# Altium project MAIN.PrjPcb
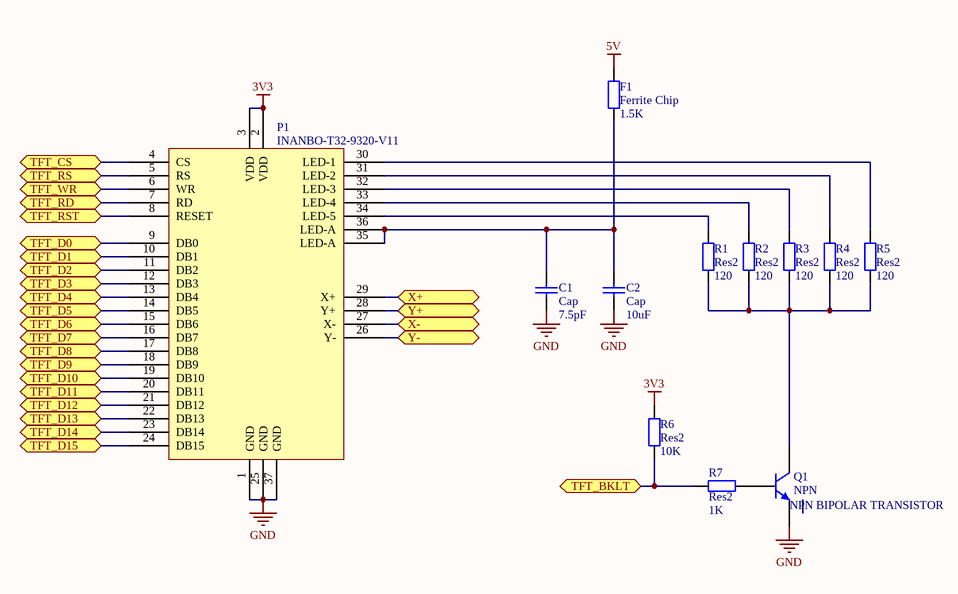
[diagram p0: LCD.SchDoc]
5 sheets, 80 parts. Net scope: flat (ports and power ports of the same name join across sheets).
Board file: MAIN.PcbDoc
Sheets:
  LCD.SchDoc
  MAIN.SchDoc
  WIFI.SchDoc
  USB.SchDoc
  RTC.SchDoc

## Sheet LCD.SchDoc
size A

### Parts
C1  Cap  value 7.5pF  [0603]
C2  Cap  value 10uF  [0805]
F1  Ferrite Chip  value 1.5K  [0603]
P1  INANBO-T32-9320-V11  [INANBO-T32-ILI9320-V11]
Q1  NPN  value NPN BIPOLAR TRANSISTOR  [SOT23_M]
R1  Res2  value 120  [0603]
R2  Res2  value 120  [0603]
R3  Res2  value 120  [0603]
R4  Res2  value 120  [0603]
R5  Res2  value 120  [0603]
R6  Res2  value 10K  [0603]
R7  Res2  value 1K  [0603]

### Ports
TFT_BKLT, TFT_CS, TFT_D0, TFT_D1, TFT_D2, TFT_D3, TFT_D4, TFT_D5, TFT_D6, TFT_D7, TFT_D8, TFT_D9, TFT_D10, TFT_D11, TFT_D12, TFT_D13, TFT_D14, TFT_D15, TFT_RD, TFT_RS, TFT_RST, TFT_WR, X+, X-, Y+, Y-

### Nets
3V3: P1.2(VDD) P1.3(VDD) R6.2
5V: F1.1
GND: C1.1 C2.1 P1.1(GND) P1.25(GND) P1.37(GND) Q1.3(E)
D0: P1.9(DB0) ; port TFT_D0
D1: P1.10(DB1) ; port TFT_D1
D2: P1.11(DB2) ; port TFT_D2
D3: P1.12(DB3) ; port TFT_D3
D4: P1.13(DB4) ; port TFT_D4
D5: P1.14(DB5) ; port TFT_D5
D6: P1.15(DB6) ; port TFT_D6
D7: P1.16(DB7) ; port TFT_D7
D8: P1.17(DB8) ; port TFT_D8
D9: P1.18(DB9) ; port TFT_D9
D10: P1.19(DB10) ; port TFT_D10
D11: P1.20(DB11) ; port TFT_D11
D12: P1.21(DB12) ; port TFT_D12
D13: P1.22(DB13) ; port TFT_D13
D14: P1.23(DB14) ; port TFT_D14
D15: P1.24(DB15) ; port TFT_D15
TFT_BKLT: R6.1 R7.2 ; port TFT_BKLT
TFT_CS: P1.4(CS) ; port TFT_CS
TFT_RD: P1.7(RD) ; port TFT_RD
TFT_RS: P1.5(RS) ; port TFT_RS
TFT_RST: P1.8(RESET) ; port TFT_RST
TFT_WR: P1.6(WR) ; port TFT_WR
X+: P1.29(X+) ; port X+
X-: P1.27(X-) ; port X-
Y+: P1.28(Y+) ; port Y+
Y-: P1.26(Y-) ; port Y-
NetC1_2: C1.2 C2.2 F1.2 P1.35(LED-A) P1.36(LED-A)
NetP1_30: P1.30(LED-1) R5.2
NetP1_31: P1.31(LED-2) R4.2
NetP1_32: P1.32(LED-3) R3.2
NetP1_33: P1.33(LED-4) R2.2
NetP1_34: P1.34(LED-5) R1.2
NetQ1_1: Q1.1(C) R1.1 R2.1 R3.1 R4.1 R5.1
NetQ1_2: Q1.2(B) R7.1

### Library data of the parts
C1 C2 = Cap: Capacitor; Supplier 1: Digi-Key
  C1: Supplier Part Number 1: 490-3565-1-ND
  C2: Supplier Part Number 1: 445-6857-1-ND
F1 = Res2: Supplier 1: Digi-Key; Supplier Part Number 1: 490-5216-1-ND
P1 = ER-TFT032-2: 3.2" TFT LCD module with touch panel; Supplier 1: INANBO; Supplier Part Number 1: INANBO-T32-9320-V11
Q1 = NPN: NPN Bipolar Transistor; pin to pad: 2>3 3>2; Supplier Part Number 1: MMBT2222ALT3GOSCT-ND; Supplier 1: Digi-Key
R1-R7 = Res2: Resistor; Supplier 1: Digi-Key
  R1-R5: Supplier Part Number 1: P120GCT-ND
  R6: Supplier Part Number 1: P10KGCT-ND
  R7: Supplier Part Number 1: 311-1.0KGRCT-ND

## Sheet MAIN.SchDoc
size B
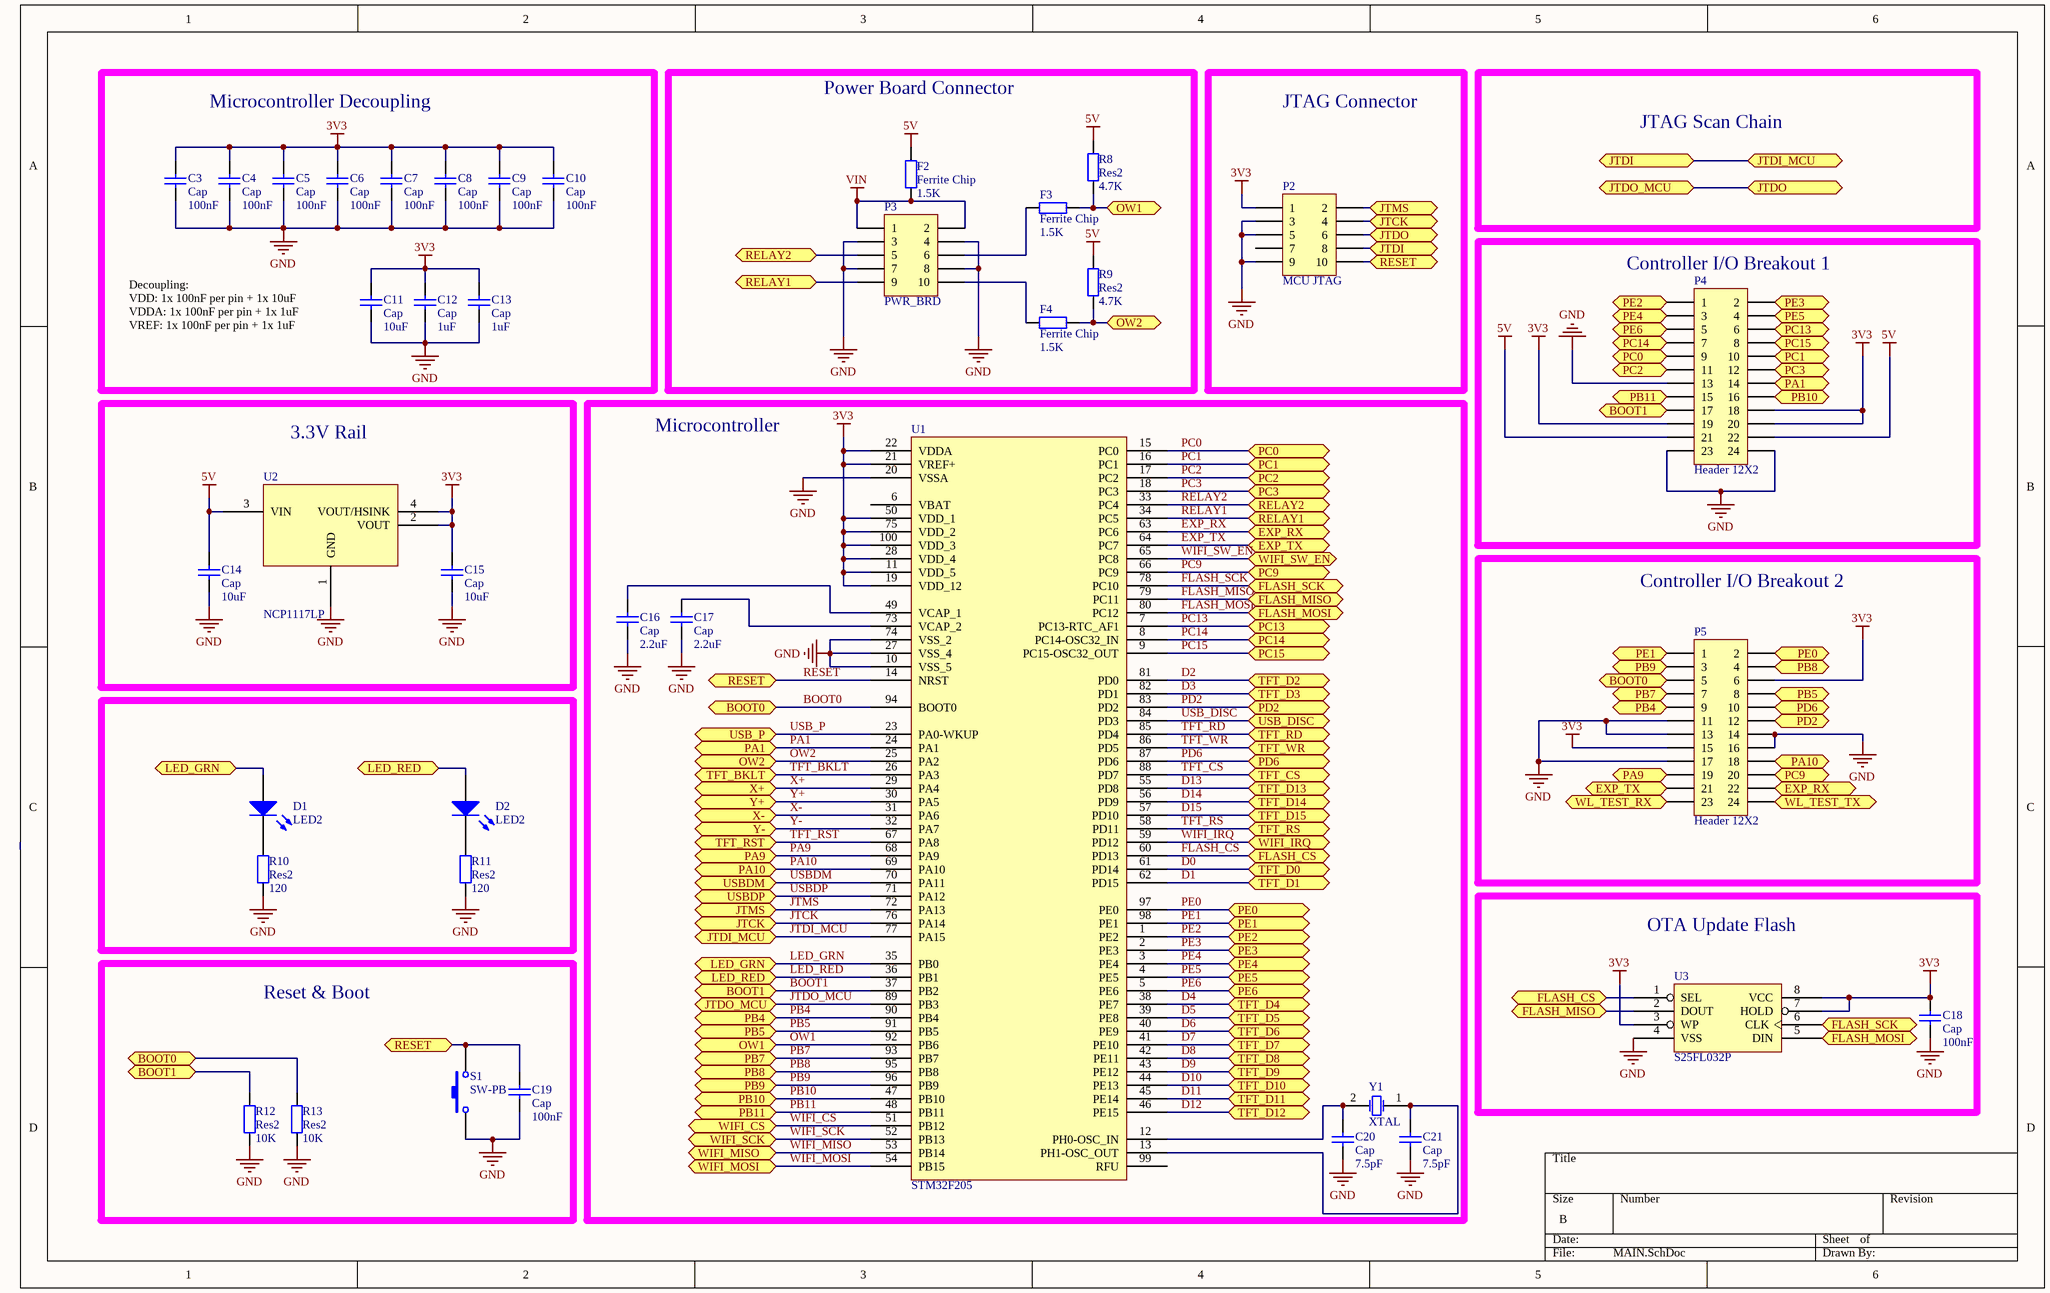
[diagram p1: MAIN.SchDoc]

### Parts
C3  Cap  value 100nF  [0603]
C4  Cap  value 100nF  [0603]
C5  Cap  value 100nF  [0603]
C6  Cap  value 100nF  [0603]
C7  Cap  value 100nF  [0603]
C8  Cap  value 100nF  [0603]
C9  Cap  value 100nF  [0603]
C10  Cap  value 100nF  [0603]
C11  Cap  value 10uF  [0805]
C12  Cap  value 1uF  [0603]
C13  Cap  value 1uF  [0603]
C14  Cap  value 10uF  [0805]
C15  Cap  value 10uF  [0805]
C16  Cap  value 2.2uF  [0603]
C17  Cap  value 2.2uF  [0603]
C18  Cap  value 100nF  [0603]
C19  Cap  value 100nF  [0603]
C20  Cap  value 7.5pF  [0603]
C21  Cap  value 7.5pF  [0603]
D1  LED2  [0603]
D2  LED2  [0603]
F2  Ferrite Chip  value 1.5K  [0603]
F3  Ferrite Chip  value 1.5K  [0603]
F4  Ferrite Chip  value 1.5K  [0603]
P2  MCU JTAG  [JTAG PTH]
P3  PWR_BRD  [HDR2X5]
P4  Header 12X2  [HDR2X12]
P5  Header 12X2  [HDR2X12]
R8  Res2  value 4.7K  [0603]
R9  Res2  value 4.7K  [0603]
R10  Res2  value 120  [0603]
R11  Res2  value 120  [0603]
R12  Res2  value 10K  [0603]
R13  Res2  value 10K  [0603]
S1  SW-PB  [FSM4JSMA]
U1  STM32F205  [LQFP-100]
U2  NCP1117LP  [SOT-223]
U3  S25FL032P  [SOC008]
Y1  XTAL  [HC49SD XTAL]

### Blocks framed on the sheet
Microcontroller Decoupling: C3-C13
Power Board Connector: F2-F4 P3 R8 R9
JTAG Connector: P2
Controller I/O Breakout 1: P4
3.3V Rail: C14 C15 U2
Microcontroller: C16 C17 C20 C21 U1 Y1
Controller I/O Breakout 2: P5
OTA Update Flash: C18 U3
Reset & Boot: C19 R12 R13 S1

### Ports
BOOT0, BOOT1, EXP_RX, EXP_TX, FLASH_CS, FLASH_MISO, FLASH_MOSI, FLASH_SCK, JTCK, JTDI, JTDI_MCU, JTDO, JTDO_MCU, JTMS, LED_GRN, LED_RED, OW1, OW2, PA1, PA9, PA10, PB4, PB5, PB7, PB8, PB9, PB10, PB11, PC0, PC1, PC2, PC3, PC9, PC13, PC14, PC15, PD2, PD6, PE0, PE1, PE2, PE3, PE4, PE5, PE6, RELAY1, RELAY2, RESET, TFT_BKLT, TFT_CS, TFT_D0, TFT_D1, TFT_D2, TFT_D3, TFT_D4, TFT_D5, TFT_D6, TFT_D7, TFT_D8, TFT_D9, TFT_D10, TFT_D11, TFT_D12, TFT_D13, TFT_D14, TFT_D15, TFT_RD, TFT_RS, TFT_RST, TFT_WR, USB_DISC, USB_P, USBDM, USBDP, WIFI_CS, WIFI_IRQ, WIFI_MISO, WIFI_MOSI, WIFI_SCK, WIFI_SW_EN, WL_TEST_RX, WL_TEST_TX, X+, X-, Y+, Y-

### Nets
3V3: C3.2 C4.2 C5.2 C6.2 C7.2 C8.2 C9.2 C10.2 C11.2 C12.2 C13.2 C15.2 C18.2 P2.1 P4.18 P4.19 P4.20 P5.6 P5.15 U1.11(VDD_5) U1.19(VDD_12) U1.21(VREF+) U1.22(VDDA) U1.28(VDD_4) U1.50(VDD_1) U1.75(VDD_2) U1.100(VDD_3) U2.2(VOUT) U2.4(VOUT/HSINK) U3.3(WP) U3.7(HOLD) U3.8(VCC)
5V: C14.2 F2.2 P4.21 P4.22 R8.2 R9.2 U2.3(VIN)
GND: C3.1 C4.1 C5.1 C6.1 C7.1 C8.1 C9.1 C10.1 C11.1 C12.1 C13.1 C14.1 C15.1 C16.1 C17.1 C18.1 C19.1 C20.1 C21.1 P2.3 P2.5 P2.9 P3.3 P3.4 P3.7 P3.8 P4.13 P4.23 P4.24 P5.11 P5.13 P5.14 P5.16 P5.17 R10.1 R11.1 R12.1 R13.1 S1.1 U1.10(VSS_5) U1.20(VSSA) U1.27(VSS_4) U1.74(VSS_2) U2.1(GND) U3.4(VSS)
VIN: F2.1 P3.1 P3.2
BOOT0: P5.5 R13.2 U1.94(BOOT0) ; port BOOT0
BOOT1: P4.17 R12.2 U1.37(PB2) ; port BOOT1
D0: U1.61(PD14) ; port TFT_D0
D1: U1.62(PD15) ; port TFT_D1
D2: U1.81(PD0) ; port TFT_D2
D3: U1.82(PD1) ; port TFT_D3
D4: U1.38(PE7) ; port TFT_D4
D5: U1.39(PE8) ; port TFT_D5
D6: U1.40(PE9) ; port TFT_D6
D7: U1.41(PE10) ; port TFT_D7
D8: U1.42(PE11) ; port TFT_D8
D9: U1.43(PE12) ; port TFT_D9
D10: U1.44(PE13) ; port TFT_D10
D11: U1.45(PE14) ; port TFT_D11
D12: U1.46(PE15) ; port TFT_D12
D13: U1.55(PD8) ; port TFT_D13
D14: U1.56(PD9) ; port TFT_D14
D15: U1.57(PD10) ; port TFT_D15
EXP_RX: P5.22 U1.63(PC6) ; port EXP_RX
EXP_TX: P5.21 U1.64(PC7) ; port EXP_TX
FLASH_CS: U1.60(PD13) U3.1(SEL) ; port FLASH_CS
FLASH_MISO: U1.79(PC11) U3.2(DOUT) ; port FLASH_MISO
FLASH_MOSI: U1.80(PC12) U3.5(DIN) ; port FLASH_MOSI
FLASH_SCK: U1.78(PC10) U3.6(CLK) ; port FLASH_SCK
JTCK: P2.4 U1.76(PA14) ; port JTCK
JTDI_MCU: P2.8 U1.77(PA15) ; port JTDI, port JTDI_MCU
JTDO_MCU: P2.6 U1.89(PB3) ; port JTDO, port JTDO_MCU
JTMS: P2.2 U1.72(PA13) ; port JTMS
LED_GRN: D1.1(A) U1.35(PB0) ; port LED_GRN
LED_RED: D2.1(A) U1.36(PB1) ; port LED_RED
OW1: F3.1 R8.1 U1.92(PB6) ; port OW1
OW2: F4.1 R9.1 U1.25(PA2) ; port OW2
PA1: P4.14 U1.24(PA1) ; port PA1
PA9: P5.19 U1.68(PA9) ; port PA9
PA10: P5.18 U1.69(PA10) ; port PA10
PB4: P5.9 U1.90(PB4) ; port PB4
PB5: P5.8 U1.91(PB5) ; port PB5
PB7: P5.7 U1.93(PB7) ; port PB7
PB8: P5.4 U1.95(PB8) ; port PB8
PB9: P5.3 U1.96(PB9) ; port PB9
PB10: P4.16 U1.47(PB10) ; port PB10
PB11: P4.15 U1.48(PB11) ; port PB11
PC0: P4.9 U1.15(PC0) ; port PC0
PC1: P4.10 U1.16(PC1) ; port PC1
PC2: P4.11 U1.17(PC2) ; port PC2
PC3: P4.12 U1.18(PC3) ; port PC3
PC9: P5.20 U1.66(PC9) ; port PC9
PC13: P4.6 U1.7(PC13-RTC_AF1) ; port PC13
PC14: P4.7 U1.8(PC14-OSC32_IN) ; port PC14
PC15: P4.8 U1.9(PC15-OSC32_OUT) ; port PC15
PD2: P5.12 U1.83(PD2) ; port PD2
PD6: P5.10 U1.87(PD6) ; port PD6
PE0: P5.2 U1.97(PE0) ; port PE0
PE1: P5.1 U1.98(PE1) ; port PE1
PE2: P4.1 U1.1(PE2) ; port PE2
PE3: P4.2 U1.2(PE3) ; port PE3
PE4: P4.3 U1.3(PE4) ; port PE4
PE5: P4.4 U1.4(PE5) ; port PE5
PE6: P4.5 U1.5(PE6) ; port PE6
RELAY1: P3.9 U1.34(PC5) ; port RELAY1
RELAY2: P3.5 U1.33(PC4) ; port RELAY2
RESET: C19.2 P2.10 S1.2 U1.14(NRST) ; port RESET
TFT_BKLT: U1.26(PA3) ; port TFT_BKLT
TFT_CS: U1.88(PD7) ; port TFT_CS
TFT_RD: U1.85(PD4) ; port TFT_RD
TFT_RS: U1.58(PD11) ; port TFT_RS
TFT_RST: U1.67(PA8) ; port TFT_RST
TFT_WR: U1.86(PD5) ; port TFT_WR
USB_DISC: U1.84(PD3) ; port USB_DISC
USB_P: U1.23(PA0-WKUP) ; port USB_P
USBDM: U1.70(PA11) ; port USBDM
USBDP: U1.71(PA12) ; port USBDP
WIFI_CS: U1.51(PB12) ; port WIFI_CS
WIFI_IRQ: U1.59(PD12) ; port WIFI_IRQ
WIFI_MISO: U1.53(PB14) ; port WIFI_MISO
WIFI_MOSI: U1.54(PB15) ; port WIFI_MOSI
WIFI_SCK: U1.52(PB13) ; port WIFI_SCK
WIFI_SW_EN: U1.65(PC8) ; port WIFI_SW_EN
WTR: P5.23 ; port WL_TEST_RX
WTT: P5.24 ; port WL_TEST_TX
X+: U1.29(PA4) ; port X+
X-: U1.31(PA6) ; port X-
Y+: U1.30(PA5) ; port Y+
Y-: U1.32(PA7) ; port Y-
NetC16_2: C16.2 U1.49(VCAP_1)
NetC17_2: C17.2 U1.73(VCAP_2)
NetC20_2: C20.2 U1.12(PH0-OSC_IN) Y1.2(OSC2)
NetC21_2: C21.2 U1.13(PH1-OSC_OUT) Y1.1(OSC1)
NetD1_2: D1.2(K) R10.2
NetD2_2: D2.2(K) R11.2
NetF3_2: F3.2 P3.6
NetF4_2: F4.2 P3.10

Not connected (* = marked no-connect by the designer): P2 7; U1 6(VBAT) 99(RFU)

### Notes on the sheet
- JTAG Scan Chain
- Decoupling:
  VDD: 1x 100nF per pin + 1x 10uF
  VDDA: 1x 100nF per pin + 1x 1uF
  VREF: 1x 100nF per pin + 1x 1uF

### Library data of the parts
C3-C21 = Cap: Capacitor; Supplier 1: Digi-Key
  C3-C10 C18 C19: Supplier Part Number 1: 399-1095-1-ND
  C11 C14 C15: Supplier Part Number 1: 445-6857-1-ND
  C12 C13: Supplier Part Number 1: 587-1242-1-ND
  C16 C17: Supplier Part Number 1: 587-2983-1-ND
  C20 C21: Supplier Part Number 1: 490-3565-1-ND
D1 D2 = LED2: Typical RED, GREEN, YELLOW, AMBER GaAs LED; Supplier 1: Digi-Key
  D1: Supplier Part Number 1: 160-1183-1-ND
  D2: Supplier Part Number 1: 160-1181-1-ND
F2-F4 = Res2: Supplier 1: Digi-Key; Supplier Part Number 1: 490-5216-1-ND
P2 P3 = Header 5X2: Header, 5-Pin, Dual row; Supplier 1: Digi-Key
  P2: Supplier Part Number 1: 609-3712-ND
  P3: Supplier Part Number 1: ED1543-ND
P4 P5 = Header 12X2: Header, 12-Pin, Dual row; Supplier 1: Digi-Key
R8-R13 = Res2: Resistor; Supplier 1: Digi-Key
  R8 R9: Supplier Part Number 1: 311-4.7KGRCT-ND
  R10 R11: Supplier Part Number 1: P120GCT-ND
  R12 R13: Supplier Part Number 1: P10KGCT-ND
S1 = SW-PB: Switch; Supplier Part Number 1: 450-1759-1-ND; Supplier 1: Digi-Key
U1 = STM32F20x-LQFP100: STMicroelectronics STM32F20x LQFP100; Supplier 1: Digi-Key; Supplier Part Number 1: 497-11161-ND
U2 = NCP1117LP: 1.0 A Low-Dropout Positive  Fixed and Adjustable  Voltage Regulators; Supplier 1: Digi-Key; Supplier Part Number 1: NCP1117LPST33T3GOSCT-ND
U3 = M25P80-VMN6TP: IC FLASH 8MBIT 75MHZ SO8N; Supplier 1: Digi-Key; Supplier Part Number 1: S25FL032P0XMFI011-ND
Y1 = XTAL: Crystal Oscillator; Supplier 1: Digi-Key; Supplier Part Number 1: 631-1010-1-ND

## Sheet WIFI.SchDoc
size A
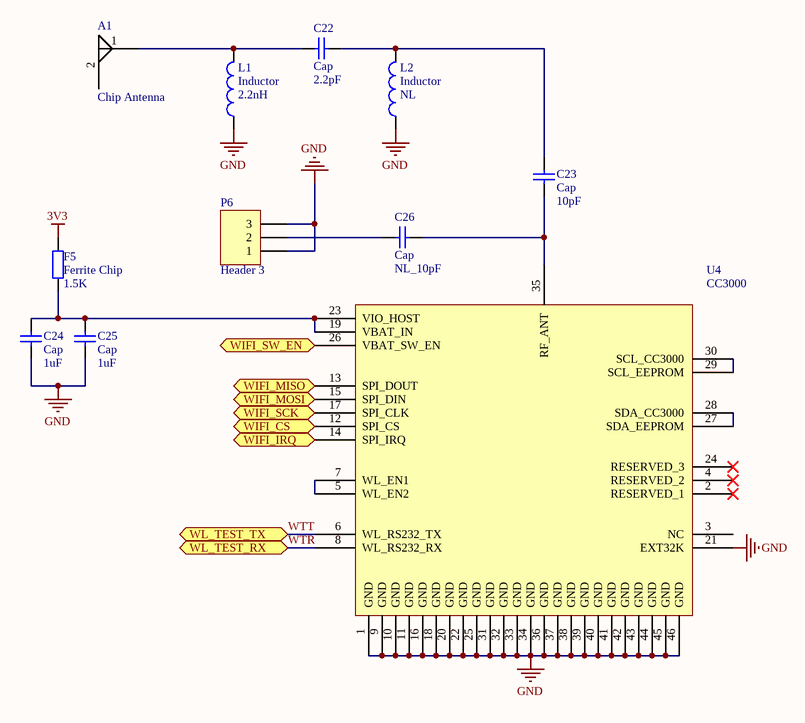
[diagram p2: WIFI.SchDoc]

### Parts
A1  Chip Antenna  [2500AT44M0400]
C22  Cap  value 2.2pF  [0402]
C23  Cap  value 10pF  [0402]
C24  Cap  value 1uF  [0603]
C25  Cap  value 1uF  [0603]
C26  Cap  value NL_10pF  [0402]
F5  Ferrite Chip  value 1.5K  [0603]
L1  Inductor  value 2.2nH  [0402]
L2  Inductor  value NL  [0402]
P6  Header 3  [U.FL-R-SMT-1]
U4  CC3000  [CC3000]

### Ports
WIFI_CS, WIFI_IRQ, WIFI_MISO, WIFI_MOSI, WIFI_SCK, WIFI_SW_EN, WL_TEST_RX, WL_TEST_TX

### Nets
3V3: F5.2
GND: C24.1 C25.1 L1.1 L2.1 P6.1 P6.3 U4.1(GND) U4.9(GND) U4.10(GND) U4.11(GND) U4.16(GND) U4.18(GND) U4.20(GND) U4.21(EXT32K) U4.22(GND) U4.25(GND) U4.31(GND) U4.32(GND) U4.33(GND) U4.34(GND) U4.36(GND) U4.37(GND) U4.38(GND) U4.39(GND) U4.40(GND) U4.41(GND) U4.42(GND) U4.43(GND) U4.44(GND) U4.45(GND) U4.46(GND)
WIFI_CS: U4.12(SPI_CS) ; port WIFI_CS
WIFI_IRQ: U4.14(SPI_IRQ) ; port WIFI_IRQ
WIFI_MISO: U4.13(SPI_DOUT) ; port WIFI_MISO
WIFI_MOSI: U4.15(SPI_DIN) ; port WIFI_MOSI
WIFI_SCK: U4.17(SPI_CLK) ; port WIFI_SCK
WIFI_SW_EN: U4.26(VBAT_SW_EN) ; port WIFI_SW_EN
WTR: U4.8(WL_RS232_RX) ; port WL_TEST_RX
WTT: U4.6(WL_RS232_TX) ; port WL_TEST_TX
NetA1_1: A1.1 C22.2 L1.2
NetC22_1: C22.1 C23.2 L2.2
NetC23_1: C23.1 C26.1 U4.35(RF_ANT)
NetC24_2: C24.2 C25.2 F5.1 U4.19(VBAT_IN) U4.23(VIO_HOST)
NetC26_2: C26.2 P6.2
NetU4_5: U4.5(WL_EN2) U4.7(WL_EN1)
NetU4_27: U4.27(SDA_EEPROM) U4.28(SDA_CC3000)
NetU4_29: U4.29(SCL_EEPROM) U4.30(SCL_CC3000)

Not connected (* = marked no-connect by the designer): A1 2; U4 2(RESERVED_1)* 3(NC) 4(RESERVED_2)* 24(RESERVED_3)*

### Library data of the parts
A1 = ANT-SMT-2: Supplier 1: Digi-Key; Supplier Part Number 1: 712-1403-1-ND
C22-C26 = Cap: Capacitor; Supplier 1: Digi-Key
  C22: Supplier Part Number 1: 490-5932-1-ND
  C23 C26: Supplier Part Number 1: 311-1014-1-ND
  C24 C25: Supplier Part Number 1: 587-1242-1-ND
F5 = Res2: Supplier 1: Digi-Key; Supplier Part Number 1: 490-5216-1-ND
P6 = Header 3: Header, 3-Pin; Supplier 1: Digi-Key
U4 = CC3000: CC3000 WLAN Module; Supplier 1: Digi-Key; Supplier Part Number 1: 296-35512-1-ND
L1 L2 = Inductor: Supplier Part Number 1: 712-1414-1-ND; Supplier 1: Digi-Key

## Sheet USB.SchDoc
size A
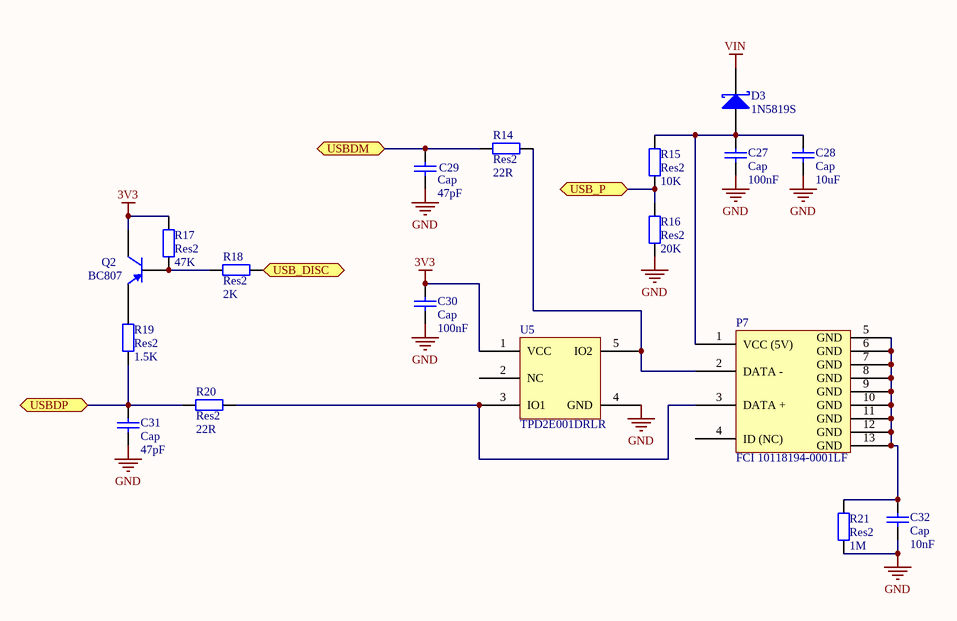
[diagram p3: USB.SchDoc]

### Parts
C27  Cap  value 100nF  [0603]
C28  Cap  value 10uF  [0805]
C29  Cap  value 47pF  [0603]
C30  Cap  value 100nF  [0603]
C31  Cap  value 47pF  [0603]
C32  Cap  value 10nF  [0603]
D3  1N5819S  [SMB]
P7  FCI 10118194-0001LF  [CONN USB MICRO B RECPT SMT R/A]
Q2  BC807  [SOT-23B_L]
R14  Res2  value 22R  [0603]
R15  Res2  value 10K  [0603]
R16  Res2  value 20K  [0603]
R17  Res2  value 47K  [0603]
R18  Res2  value 2K  [0603]
R19  Res2  value 1.5K  [0603]
R20  Res2  value 22R  [0603]
R21  Res2  value 1M  [0603]
U5  TPD2E001DRLR  [SOT-553]

### Ports
USB_DISC, USB_P, USBDM, USBDP

### Nets
3V3: C30.2 Q2.1(C) R17.1 U5.1(VCC)
GND: C27.1 C28.1 C29.1 C30.1 C31.1 C32.1 R16.1 R21.2 U5.4(GND)
VIN: D3.2(K)
USB_DISC: R18.2 ; port USB_DISC
USB_P: R15.1 R16.2 ; port USB_P
USBDM: C29.2 R14.2 ; port USBDM
USBDP: C31.2 R19.2 R20.2 ; port USBDP
NetC27_2: C27.2 C28.2 D3.1(A) P7.1(VCC_(5V)) R15.2
NetC32_2: C32.2 P7.5(GND) P7.6(GND) P7.7(GND) P7.8(GND) P7.9(GND) P7.10(GND) P7.11(GND) P7.12(GND) P7.13(GND) R21.1
NetP7_2: P7.2(DATA_-) R14.1 U5.5(IO2)
NetP7_3: P7.3(DATA_+) R20.1 U5.3(IO1)
NetQ2_2: Q2.2(B) R17.2 R18.1
NetQ2_3: Q2.3(E) R19.1

Not connected (* = marked no-connect by the designer): P7 4(ID_(NC)); U5 2(NC)

### Library data of the parts
C27 C28 C30 = Cap: Capacitor; Supplier 1: Digi-Key
  C27 C30: Supplier Part Number 1: 399-1095-1-ND
  C28: Supplier Part Number 1: 445-6857-1-ND
C29 C31 = Cap: Capacitor; Manufacturer: Samsung Electro-Mechanics America, Inc; Manufacturer Part Number: CL10C470JB8NCNC; Description: CAP CER 47PF 50V 5% NP0 0603; Tolerance: ±5%; Voltage - Rated: 50V; Temperature Coefficient: C0G, NP0; Supplier 1: Digi-Key; Supplier Part Number 1: 1276-2296-1-ND; RoHS: RoHS Compliant; Category: Capacitors; Stock 1: 191448; Pricing 1: 1=0.1, 10=0.029, 25=0.0204, 100=0.0132, 500=0.00924, 1000=0.0072 (USD); Packaging: Cut Tape (CT); Capacitance: 47pF; Mounting Type: Surface Mount, MLCC; Operating Temperature: -55°C ~ 125°C; Applications: General Purpose; Ratings: -; Package / Case: 0603 (1608 Metric); Size / Dimension: 0.063" L x 0.031" W (1.60mm x 0.80mm); Height - Seated (Max): -; Thickness (Max): 0.035" (0.90mm); Lead Spacing: -; Features: -; Lead Style: -; ComponentLink1URL: http://www.samsungsem.com/kr/front/downloadcms.do?path=/kr/support/product-search/mlcc/__icsFiles/afieldfile/2014/11/05&fileName=S_CL10C470JB8NCNC.pdf; ComponentLink1Description: http://www.samsungsem.com/kr/front/downloadcms.do?path=/kr/support/product-search/mlcc/__icsFiles/afieldfile/2014/11/05&fileName=S_CL10C470JB8NCNC.pdf
C32 = Cap: Capacitor; Manufacturer: Samsung Electro-Mechanics America, Inc; Manufacturer Part Number: CL10B103JB8NNNC; Description: CAP CER 10000PF 50V 5% X7R 0603; Capacitance: 10000pF; Tolerance: ±5%; Voltage - Rated: 50V; Temperature Coefficient: X7R; Supplier 1: Digi-Key; Supplier Part Number 1: 1276-1103-1-ND; RoHS: RoHS Compliant; Category: Capacitors; Stock 1: 65936; Pricing 1: 1=0.1, 10=0.036, 25=0.0256, 100=0.0165, 500=0.01156, 1000=0.009 (USD); Packaging: Cut Tape (CT); Mounting Type: Surface Mount, MLCC; Operating Temperature: -55°C ~ 125°C; Applications: General Purpose; Ratings: -; Package / Case: 0603 (1608 Metric); Size / Dimension: 0.063" L x 0.031" W (1.60mm x 0.80mm); Height - Seated (Max): -; Thickness (Max): 0.035" (0.90mm); Lead Spacing: -; Features: -; Lead Style: -; ComponentLink1URL: http://www.samsungsem.com/kr/front/downloadcms.do?path=/kr/support/product-search/mlcc/__icsFiles/afieldfile/2014/11/05&fileName=S_CL10B103JB8NNNC.pdf; ComponentLink1Description: http://www.samsungsem.com/kr/front/downloadcms.do?path=/kr/support/product-search/mlcc/__icsFiles/afieldfile/2014/11/05&fileName=S_CL10B103JB8NNNC.pdf
D3 = D Schottky: Schottky Diode; Manufacturer: Diodes Incorporated; Manufacturer Part Number: 1N5819HW-7-F; Description: DIODE SCHOTTKY 40V 1A SOD123; Voltage - DC Reverse (Vr) (Max): 40V; Current - Average Rectified (Io): 1A; Voltage - Forward (Vf) (Max) @ If: 450mV @ 1A; Speed: Fast Recovery =< 500ns, > 200mA (Io); Current - Reverse Leakage @ Vr: 1mA @ 40V; Capacitance @ Vr, F: 60pF @ 4V, 1MHz; Published: 8-Jun-2000; LatestRevisionDate: 17-Jul-2002; LatestRevisionNote: Re-released for DXP Platform.; PackageReference: SMB; Publisher: Altium Limited; PackageDescription: DO-214-AA/SMB; 2 C-Bend Leads; Body 5.3 x 3.6 mm, inc. leads (LxW); Code_JEDEC: DO-214-AA; Supplier 1: Digi-Key; Supplier Part Number 1: 1N5819HW-FDICT-ND; RoHS: RoHS Compliant; Category: Discrete Semiconductor Products; Stock 1: 628950; Pricing 1: 1=0.52, 10=0.371, 25=0.2884, 100=0.2184, 250=0.1544, 500=0.1236, 1000=0.0948 (USD); Packaging: Cut Tape (CT); Diode Type: Schottky; Reverse Recovery Time (trr): -; Mounting Type: Surface Mount; Package / Case: SOD-123; Supplier Device Package: SOD-123; Operating Temperature - Junction: -65°C ~ 125°C; ComponentLink1URL: http://www.diodes.com/datasheets/ds30217.pdf; ComponentLink1Description: http://www.diodes.com/datasheets/ds30217.pdf
P7 = FCI 10118194-0001LF: CONN USB MICRO B RECPT SMT R/A
Q2 = PNP: PNP Bipolar Transistor; Manufacturer: NXP Semiconductors; Manufacturer Part Number: BC807-40,215; Description: TRANS PNP 45V 0.5A SOT23; Current - Collector (Ic) (Max): 500mA; Voltage - Collector Emitter Breakdown (Max): 45V; Vce Saturation (Max) @ Ib, Ic: 700mV @ 50mA, 500mA; DC Current Gain (hFE) (Min) @ Ic, Vce: 250 @ 100mA, 1V; Power - Max: 250mW; Frequency - Transition: 80MHz; Published: 8-Jun-2000; LatestRevisionDate: 29-May-2009; LatestRevisionNote: IPC-7351 Footprint Added.; PackageVersion: Aug-1999; PackageReference: SOT-23B; Publisher: Altium Limited; PackageDescription: 3-Pin SOT-23 Package 0.95 mm Pitch, 2.4 mm Lead Span; Supplier 1: Digi-Key; Supplier Part Number 1: 568-1629-1-ND; RoHS: RoHS Compliant; Category: Discrete Semiconductor Products; Stock 1: 87848; Pricing 1: 1=0.15, 10=0.133, 25=0.1212, 100=0.0871, 250=0.05132, 500=0.04258, 1000=0.02905 (USD); Packaging: Cut Tape (CT); Transistor Type: PNP; Current - Collector Cutoff (Max): -; Mounting Type: Surface Mount; Package / Case: TO-236-3, SC-59, SOT-23-3; Supplier Device Package: SOT-23 (TO-236AB); ComponentLink1URL: http://www.nxp.com/documents/data_sheet/BC807_BC807W_BC327.pdf; ComponentLink1Description: http://www.nxp.com/documents/data_sheet/BC807_BC807W_BC327.pdf
R14 R20 = Res2: Resistor; Manufacturer: Panasonic Electronic Components; Manufacturer Part Number: ERJ-3EKF22R0V; Description: RES SMD 22 OHM 1% 1/10W 0603; Resistance (Ohms): 22; Tolerance: ±1%; Power (Watts): 0.1W, 1/10W; Temperature Coefficient: ±100ppm/°C; Supplier 1: Digi-Key; Supplier Part Number 1: P22.0HCT-ND; RoHS: RoHS Compliant; Category: Resistors; Stock 1: 210130; Pricing 1: 1=0.1, 50=0.015, 100=0.0114, 250=0.00844, 500=0.00624, 1000=0.00416, 2500=0.00351 (USD); Packaging: Cut Tape (CT); Composition: Thick Film; Features: Automotive AEC-Q200; Operating Temperature: -55°C ~ 155°C; Package / Case: 0603 (1608 Metric); Supplier Device Package: 0603; Size / Dimension: 0.063" L x 0.031" W (1.60mm x 0.80mm); Height: 0.022" (0.55mm); Number of Terminations: 2; ComponentLink1URL: http://industrial.panasonic.com/www-cgi/jvcr13pz.cgi?E+PZ+3+AOA0002+ERJ3EKF22R0V+7+WW; ComponentLink1Description: http://industrial.panasonic.com/www-cgi/jvcr13pz.cgi?E+PZ+3+AOA0002+ERJ3EKF22R0V+7+WW
R15 = Res2: Resistor; Manufacturer: Panasonic Electronic Components; Manufacturer Part Number: ERJ-3GEYJ103V; Description: RES SMD 10K OHM 5% 1/10W 0603; Tolerance: ±5%; Power (Watts): 0.1W, 1/10W; Temperature Coefficient: ±200ppm/°C; Supplier 1: Digi-Key; Supplier Part Number 1: P10KGCT-ND; RoHS: RoHS Compliant; Category: Resistors; Stock 1: 3887859; Pricing 1: 1=0.1, 50=0.0126, 100=0.0096, 250=0.00716, 500=0.00528, 1000=0.00352, 2500=0.00297 (USD); Packaging: Cut Tape (CT); Resistance (Ohms): 10k; Composition: Thick Film; Features: Automotive AEC-Q200; Operating Temperature: -55°C ~ 155°C; Package / Case: 0603 (1608 Metric); Supplier Device Package: 0603; Size / Dimension: 0.063" L x 0.031" W (1.60mm x 0.80mm); Height: 0.022" (0.55mm); Number of Terminations: 2; ComponentLink1URL: http://industrial.panasonic.com/www-cgi/jvcr13pz.cgi?E+PZ+3+AOA0001+ERJ3GEYJ103V+7+WW; ComponentLink1Description: http://industrial.panasonic.com/www-cgi/jvcr13pz.cgi?E+PZ+3+AOA0001+ERJ3GEYJ103V+7+WW
R16 = Res2: Resistor; Manufacturer: Samsung Electro-Mechanics America, Inc; Manufacturer Part Number: RC1608F203CS; Description: RES SMD 20K OHM 1% 1/10W 0603; Tolerance: ±1%; Power (Watts): 0.1W, 1/10W; Temperature Coefficient: ±100ppm/°C; Supplier 1: Digi-Key; Supplier Part Number 1: 1276-4768-1-ND; RoHS: RoHS Compliant; Category: Resistors; Stock 1: 9626; Pricing 1: 1=0.1, 10=0.011, 25=0.0084, 100=0.0047, 500=0.00286, 1000=0.0021, 2500=0.00182 (USD); Packaging: Cut Tape (CT); Resistance (Ohms): 20k; Composition: Thick Film; Features: -; Operating Temperature: -55°C ~ 155°C; Package / Case: 0603 (1608 Metric); Supplier Device Package: 0603 (1608 Metric); Size / Dimension: 0.063" L x 0.031" W (1.60mm x 0.80mm); Height: 0.022" (0.55mm); Number of Terminations: 2; ComponentLink1URL: http://www.samsungsem.com/global/support/library/product-catalog/__icsFiles/afieldfile/2015/01/12/CHIP_RESISTOR_150112_1.pdf; ComponentLink1Description: http://www.samsungsem.com/global/support/library/product-catalog/__icsFiles/afieldfile/2015/01/12/CHIP_RESISTOR_150112_1.pdf
R17 = Res2: Resistor; Manufacturer: Samsung Electro-Mechanics America, Inc; Manufacturer Part Number: RC1608F473CS; Description: RES SMD 47K OHM 1% 1/10W 0603; Tolerance: ±1%; Power (Watts): 0.1W, 1/10W; Temperature Coefficient: ±100ppm/°C; Supplier 1: Digi-Key; Supplier Part Number 1: 1276-4808-1-ND; RoHS: RoHS Compliant; Category: Resistors; Stock 1: 3886; Pricing 1: 1=0.1, 10=0.011, 25=0.0084, 100=0.0047, 500=0.00286, 1000=0.0021, 2500=0.00182 (USD); Packaging: Cut Tape (CT); Resistance (Ohms): 47k; Composition: Thick Film; Features: -; Operating Temperature: -55°C ~ 155°C; Package / Case: 0603 (1608 Metric); Supplier Device Package: 0603 (1608 Metric); Size / Dimension: 0.063" L x 0.031" W (1.60mm x 0.80mm); Height: 0.022" (0.55mm); Number of Terminations: 2; ComponentLink1URL: http://www.samsungsem.com/global/support/library/product-catalog/__icsFiles/afieldfile/2015/01/12/CHIP_RESISTOR_150112_1.pdf; ComponentLink1Description: http://www.samsungsem.com/global/support/library/product-catalog/__icsFiles/afieldfile/2015/01/12/CHIP_RESISTOR_150112_1.pdf
R18 = Res2: Resistor; Manufacturer: Samsung Electro-Mechanics America, Inc; Manufacturer Part Number: RC1608F202CS; Description: RES SMD 2K OHM 1% 1/10W 0603; Tolerance: ±1%; Power (Watts): 0.1W, 1/10W; Temperature Coefficient: ±100ppm/°C; Supplier 1: Digi-Key; Supplier Part Number 1: 1276-3495-1-ND; RoHS: RoHS Compliant; Category: Resistors; Stock 1: 2703; Pricing 1: 1=0.1, 10=0.011, 25=0.0084, 100=0.0047, 500=0.00286, 1000=0.0021, 2500=0.00182 (USD); Packaging: Cut Tape (CT); Resistance (Ohms): 2k; Composition: Thick Film; Features: -; Operating Temperature: -55°C ~ 155°C; Package / Case: 0603 (1608 Metric); Supplier Device Package: 0603 (1608 Metric); Size / Dimension: 0.063" L x 0.031" W (1.60mm x 0.80mm); Height: 0.022" (0.55mm); Number of Terminations: 2; ComponentLink1URL: http://www.samsungsem.com/global/support/library/product-catalog/__icsFiles/afieldfile/2015/01/12/CHIP_RESISTOR_150112_1.pdf; ComponentLink1Description: http://www.samsungsem.com/global/support/library/product-catalog/__icsFiles/afieldfile/2015/01/12/CHIP_RESISTOR_150112_1.pdf
R19 = Res2: Resistor; Manufacturer: Samsung Electro-Mechanics America, Inc; Manufacturer Part Number: RC1608F152CS; Description: RES SMD 1.5K OHM 1% 1/10W 0603; Tolerance: ±1%; Power (Watts): 0.1W, 1/10W; Temperature Coefficient: ±100ppm/°C; Supplier 1: Digi-Key; Supplier Part Number 1: 1276-4660-1-ND; RoHS: RoHS Compliant; Category: Resistors; Stock 1: 40182; Pricing 1: 1=0.1, 10=0.011, 25=0.0084, 100=0.0047, 500=0.00286, 1000=0.0021, 2500=0.00182 (USD); Packaging: Cut Tape (CT); Resistance (Ohms): 1.5k; Composition: Thick Film; Features: -; Operating Temperature: -55°C ~ 155°C; Package / Case: 0603 (1608 Metric); Supplier Device Package: 0603 (1608 Metric); Size / Dimension: 0.063" L x 0.031" W (1.60mm x 0.80mm); Height: 0.022" (0.55mm); Number of Terminations: 2; ComponentLink1URL: http://www.samsungsem.com/global/support/library/product-catalog/__icsFiles/afieldfile/2015/01/12/CHIP_RESISTOR_150112_1.pdf; ComponentLink1Description: http://www.samsungsem.com/global/support/library/product-catalog/__icsFiles/afieldfile/2015/01/12/CHIP_RESISTOR_150112_1.pdf
R21 = Res2: Resistor; Manufacturer: Yageo; Manufacturer Part Number: RC0603FR-071ML; Description: RES SMD 1M OHM 1% 1/10W 0603; Tolerance: ±1%; Power (Watts): 0.1W, 1/10W; Temperature Coefficient: ±100ppm/°C; Supplier 1: Digi-Key; Supplier Part Number 1: 311-1.00MHRCT-ND; RoHS: RoHS Compliant; Category: Resistors; Stock 1: 2145720; Pricing 1: 1=0.1, 10=0.015, 25=0.0108, 100=0.006, 250=0.00456, 500=0.00364, 1000=0.00268, 2500=0.00233 (USD); Packaging: Cut Tape (CT); Resistance (Ohms): 1M; Composition: Thick Film; Features: Moisture Resistant; Operating Temperature: -55°C ~ 155°C; Package / Case: 0603 (1608 Metric); Supplier Device Package: 0603; Size / Dimension: 0.063" L x 0.031" W (1.60mm x 0.80mm); Height: 0.022" (0.55mm); Number of Terminations: 2; ComponentLink1URL: http://www.yageo.com/documents/recent/PYu-RC_Group_51_RoHS_L_1.pdf; ComponentLink1Description: http://www.yageo.com/documents/recent/PYu-RC_Group_51_RoHS_L_1.pdf
U5 = TPD2E001DRLR: TVS DIODE 5.5VWM 100VC SOT5; Manufacturer: Texas Instruments; Bidirectional Channels: 2; Voltage - Reverse Standoff (Typ): 5.5V (Max); Voltage - Breakdown (Min): 11V; Voltage - Clamping (Max) @ Ipp: 100V; Power Line Protection: Yes; Supplier 1: Digi-Key; Supplier Part Number 1: 296-21883-1-ND; Manufacturer Part Number: TPD2E001DRLR; RoHS: RoHS Compliant; Category: Circuit Protection; Stock 1: 66831; Pricing 1: 1=0.63, 10=0.527, 25=0.462, 100=0.3955, 250=0.34304, 500=0.29056, 750=0.25088, 1000=0.224 (USD); Packaging: Cut Tape (CT); Type: Steering (Rail to Rail); Unidirectional Channels: -; Current - Peak Pulse (10/1000µs): -; Power - Peak Pulse: -; Applications: General Purpose; Capacitance @ Frequency: -; Operating Temperature: -40°C ~ 85°C (TA); Mounting Type: Surface Mount; Package / Case: SOT-553; Supplier Device Package: 5-SOT; ComponentLink1URL: http://www.ti.com/lit/ds/symlink/tpd2e001.pdf; ComponentLink1Description: http://www.ti.com/lit/ds/symlink/tpd2e001.pdf

## Sheet RTC.SchDoc
size A

## Nets that join several sheets
3V3: LCD (P1.2 P1.3 R6.2), MAIN (32 pins), WIFI (F5.2), USB (C30.2 Q2.1 R17.1 U5.1)
5V: LCD (F1.1), MAIN (7 pins)
GND: LCD (6 pins), MAIN (45 pins), WIFI (31 pins), USB (9 pins)
VIN: MAIN (F2.1 P3.1 P3.2), USB (D3.2)
D0: LCD (P1.9), MAIN (U1.61)
D1: LCD (P1.10), MAIN (U1.62)
D2: LCD (P1.11), MAIN (U1.81)
D3: LCD (P1.12), MAIN (U1.82)
D4: LCD (P1.13), MAIN (U1.38)
D5: LCD (P1.14), MAIN (U1.39)
D6: LCD (P1.15), MAIN (U1.40)
D7: LCD (P1.16), MAIN (U1.41)
D8: LCD (P1.17), MAIN (U1.42)
D9: LCD (P1.18), MAIN (U1.43)
D10: LCD (P1.19), MAIN (U1.44)
D11: LCD (P1.20), MAIN (U1.45)
D12: LCD (P1.21), MAIN (U1.46)
D13: LCD (P1.22), MAIN (U1.55)
D14: LCD (P1.23), MAIN (U1.56)
D15: LCD (P1.24), MAIN (U1.57)
TFT_BKLT: LCD (R6.1 R7.2), MAIN (U1.26)
TFT_CS: LCD (P1.4), MAIN (U1.88)
TFT_RD: LCD (P1.7), MAIN (U1.85)
TFT_RS: LCD (P1.5), MAIN (U1.58)
TFT_RST: LCD (P1.8), MAIN (U1.67)
TFT_WR: LCD (P1.6), MAIN (U1.86)
USB_DISC: MAIN (U1.84), USB (R18.2)
USB_P: MAIN (U1.23), USB (R15.1 R16.2)
USBDM: MAIN (U1.70), USB (C29.2 R14.2)
USBDP: MAIN (U1.71), USB (C31.2 R19.2 R20.2)
WIFI_CS: MAIN (U1.51), WIFI (U4.12)
WIFI_IRQ: MAIN (U1.59), WIFI (U4.14)
WIFI_MISO: MAIN (U1.53), WIFI (U4.13)
WIFI_MOSI: MAIN (U1.54), WIFI (U4.15)
WIFI_SCK: MAIN (U1.52), WIFI (U4.17)
WIFI_SW_EN: MAIN (U1.65), WIFI (U4.26)
WTR: MAIN (P5.23), WIFI (U4.8)
WTT: MAIN (P5.24), WIFI (U4.6)
X+: LCD (P1.29), MAIN (U1.29)
X-: LCD (P1.27), MAIN (U1.31)
Y+: LCD (P1.28), MAIN (U1.30)
Y-: LCD (P1.26), MAIN (U1.32)

## Assembly variants
Production: not fitted C26 L2 P2 P4 P5 P6